# EAGLE design RavenLRS-Breakout (EAGLE 9.1.0)
REV: 1
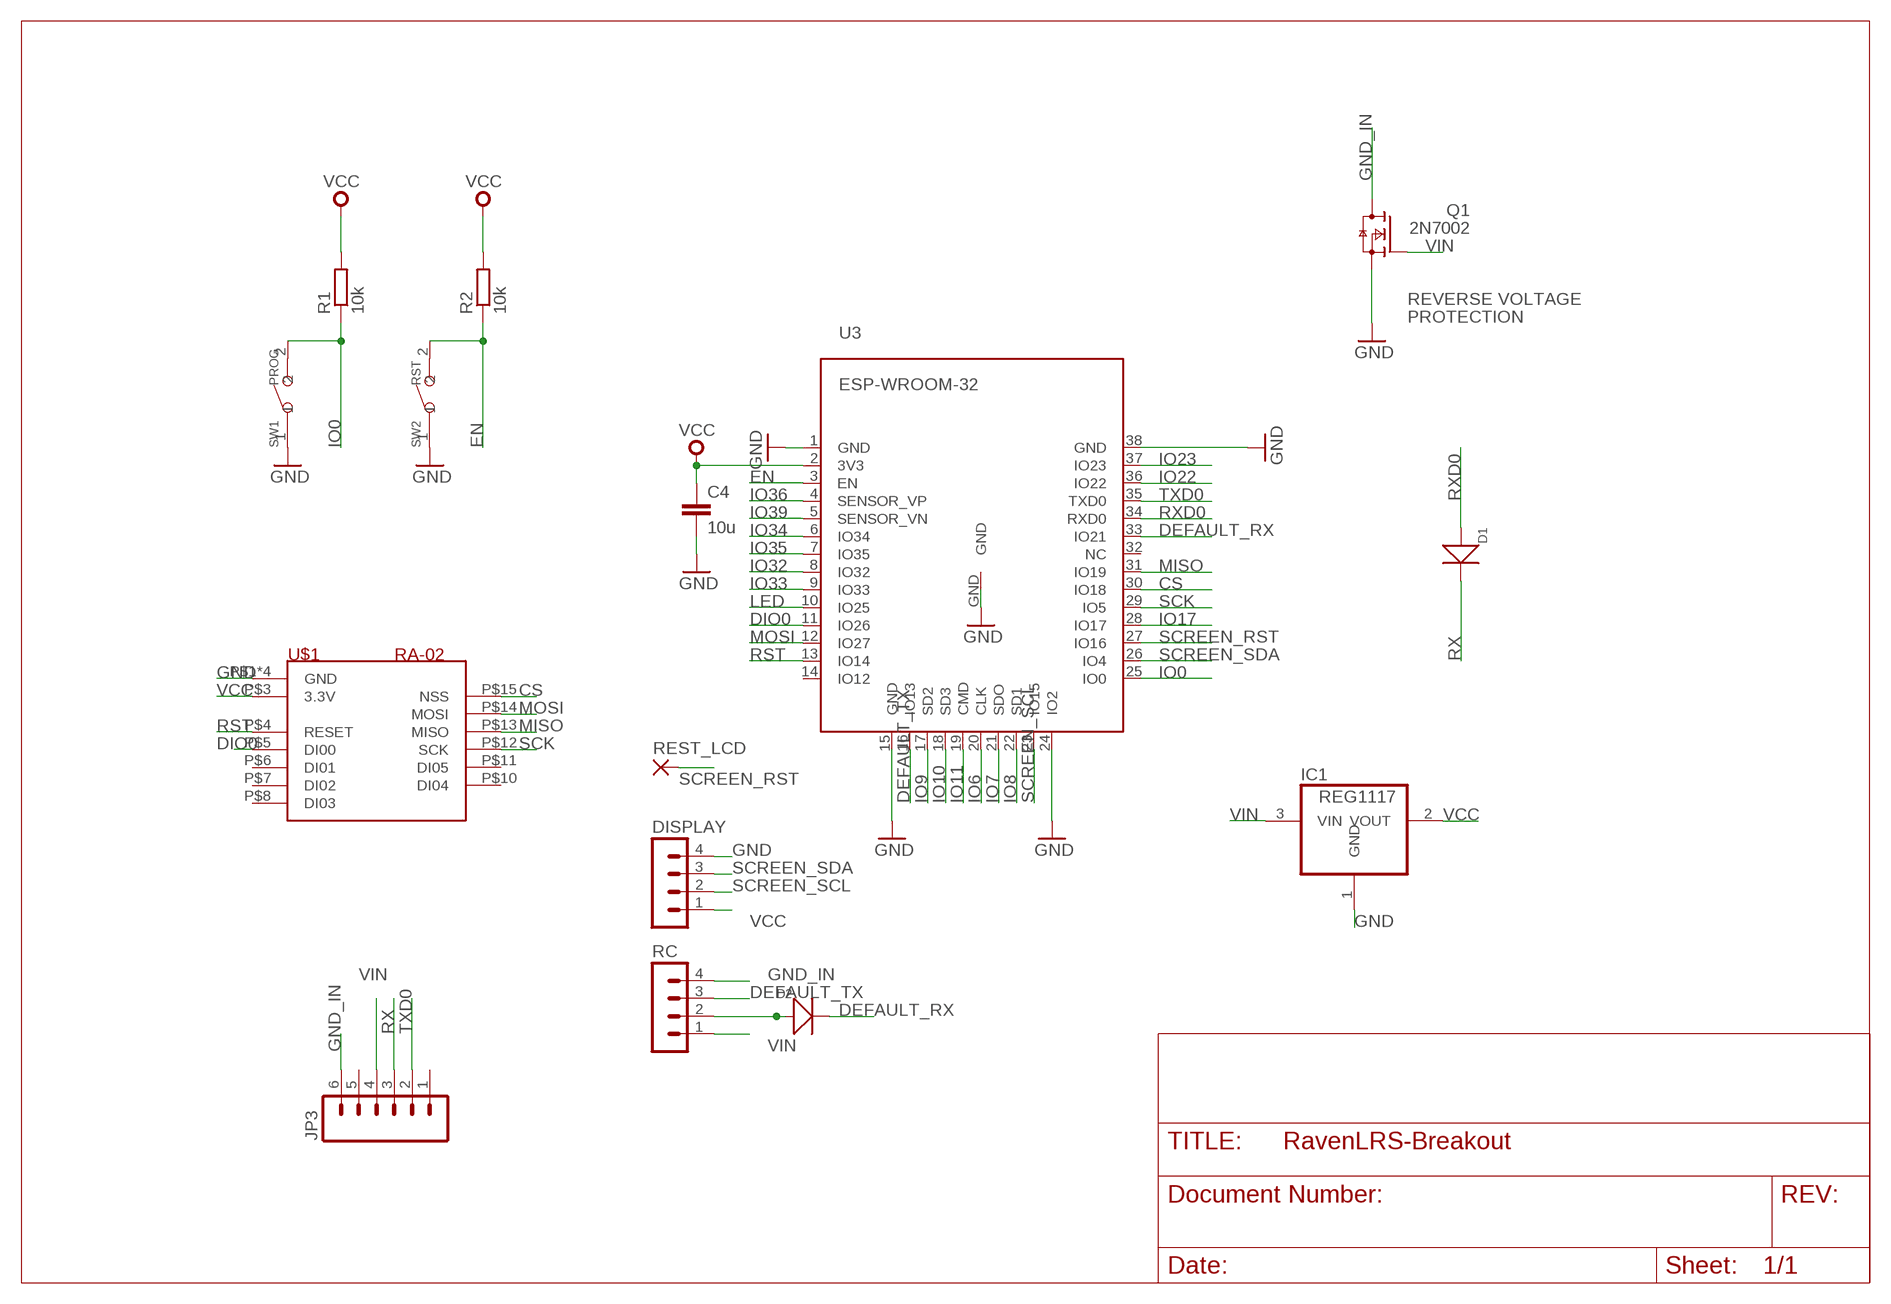
[diagram p0: schematic, sheet 1]

## Parts
C4  10u  C-EUC0603  [C0603]
D1  DIODE'0805'  [SOD-323]
D2  DIODE'0805'  [SOD-323]
DISPLAY  MA04-1  [MA04-1]
IC1  REG1117  [SOT223]
JP3  M06SILK_FEMALE_PTH  [1X06]
Q1  2N7002  2N7002E  [SOT23]
R1  10k  R-EU_R0603  [R0603]
R2  10k  R-EU_R0603  [R0603]
RC  MA04-1  [MA04-1]
REST_LCD  SMD2  [SMD1,27-2,54]
SW1  PROG  SMD-BUTTON(2P-6.0X3.0X2.5MM)-DHT-1163S  [SW2-4.0-6.0X3.0X2.5MM]
SW2  RST  SMD-BUTTON(2P-6.0X3.0X2.5MM)-DHT-1163S  [SW2-4.0-6.0X3.0X2.5MM]
U3  ESP-WROOM-32  [ESP-WROOM-32]
U$1  RA-02  [RA-02]

## Nets
CS: U3.30(IO18) U$1.P$15(NSS)
DEFAULT_RX: D2.- U3.33(IO21)
DEFAULT_TX: RC.3 U3.16(IO13)
DIO0: U3.11(IO26) U$1.P$5(DI00)
EN: R2.1 SW2.2 U3.3(EN)
GND [gnd]: C4.2 DISPLAY.4 IC1.1(GND) Q1.2(S) SW1.1 SW2.1 U3.1(GND) U3.15(GND) U3.24(IO2) U3.38(GND) U3.GND U$1.P$1(GND) U$1.P$2(GND) U$1.P$9(GND) U$1.P$16(GND)
GND_IN [gnd]: JP3.6 Q1.3(D) RC.4
IO0: R1.1 SW1.2 U3.25(IO0)
IO6: U3.20(CLK)
IO7: U3.21(SDO)
IO8: U3.22(SD1)
IO9: U3.17(SD2)
IO10: U3.18(SD3)
IO11: U3.19(CMD)
IO17: U3.28(IO17)
IO22: U3.36(IO22)
IO23: U3.37(IO23)
IO32: U3.8(IO32)
IO33: U3.9(IO33)
IO34: U3.6(IO34)
IO35: U3.7(IO35)
IO36: U3.4(SENSOR_VP)
IO39: U3.5(SENSOR_VN)
LED: U3.10(IO25)
MISO: U3.31(IO19) U$1.P$13(MISO)
MOSI: U3.12(IO27) U$1.P$14(MOSI)
N$7: D2.+ RC.2
RST: U3.13(IO14) U$1.P$4(RESET)
RX: D1.- JP3.3
RXD0: D1.+ U3.34(RXD0)
SCK: U3.29(IO5) U$1.P$12(SCK)
SCREEN_RST: REST_LCD.1(P) U3.27(IO16)
SCREEN_SCL: DISPLAY.2 U3.23(IO15)
SCREEN_SDA: DISPLAY.3 U3.26(IO4)
TXD0: JP3.2 U3.35(TXD0)
VCC [vcc]: C4.1 DISPLAY.1 IC1.2(VOUT) R1.2 R2.2 U3.2(3V3) U$1.P$3(3.3V)
VIN: IC1.3(VIN) JP3.4 Q1.1(G) RC.1
Unconnected: JP3.1 JP3.5 U3.14(IO12) U3.32(NC) U$1.P$6(DI01) U$1.P$7(DI02) U$1.P$8(DI03) U$1.P$10(DI04) U$1.P$11(DI05)

## Notes on the sheet
- REVERSE VOLTAGE
- PROTECTION

## Library data of the parts
C4 = rcl:C-EU: CAPACITOR, European symbol; SPICEPREFIX: C
D1 D2 = Seeed-OPL-Diode:DIODE*
DISPLAY RC = con-lstb:MA04-1: PIN HEADER; OC_FARNELL: unknown; OC_NEWARK: unknown
IC1 = burr-brown:REG1117: 800mA and 1A Low Dropout (LDO) Positive Regulator 1.8V, 2.5V, 2.85V, 3.3V, 5V, and Adj; MPN: REG1117; OC_FARNELL: 1097566; OC_NEWARK: 14P6981
JP3 = SparkFun-Connectors:M06: Header 6 Standard 6-pin 0.1" header. Use with straight break away headers (SKU : PRT-00116), right angle break away headers (PRT-00553), swiss pins (PRT-00743), machine pins (PRT-00117), and female headers (PRT-00115). Molex polarized connector foot print use with SKU : PRT-08094 with associated crimp pins and housings. NOTES ON THE VARIANTS LOCK and LOCK_LONGPADS... This footprint was designed to help hold the alignment of a through-hole component (i.e. 6-pin header) while soldering it into place. You may notice that each hole has been shifted either up or down by 0.005 of an inch from it's more standard position (which is a perfectly straight line). This slight alteration caused the pins (the squares in the middle) to touch the edges of the holes. Because they are alternating, it causes a "brace" to hold the component in place. 0.005 has proven to be the perfect amount of "off-center" position when using our standard breakaway headers. Although looks a little odd when you look at the bare footprint, once you have a header in there, the alteration is very hard to notice. Also,if you push a header all the way into place, it is covered up entirely on the bottom side. This idea of altering the position of holes to aid alignment will be further integrated into the Sparkfun Library for other footprints. It can help hold any component with 3 or more connection pins.; PROD_ID: CONN-08437
Q1 = nxp_60_1_1:2N7002: N-channel TrenchMOS FET N-channel enhancement mode Field-Effect Transistor (FET) in a plastic package using TrenchMOS technology. AAL Eindhoven MK
R1 R2 = rcl:R-EU_: RESISTOR, European symbol; SPICEPREFIX: R
REST_LCD = wirepad:SMD2: SMD PAD
SW1 SW2 = Seeed-OPL-Switch:SMD-BUTTON(2P-6.0X3.0X2.5MM): 311020029
U3 = esp32:ESP-WROOM-32
U$1 = AI-THINKER:RA-02

## Net classes
0 default: width 0.254 mm, drill 0.305 mm, clearance 0.152 mm
1 gnd: width 0.635 mm, drill 0.635 mm, clearance 0.254 mm
2 vcc: width 0.406 mm, drill 0.406 mm, clearance 0.254 mm

## Board
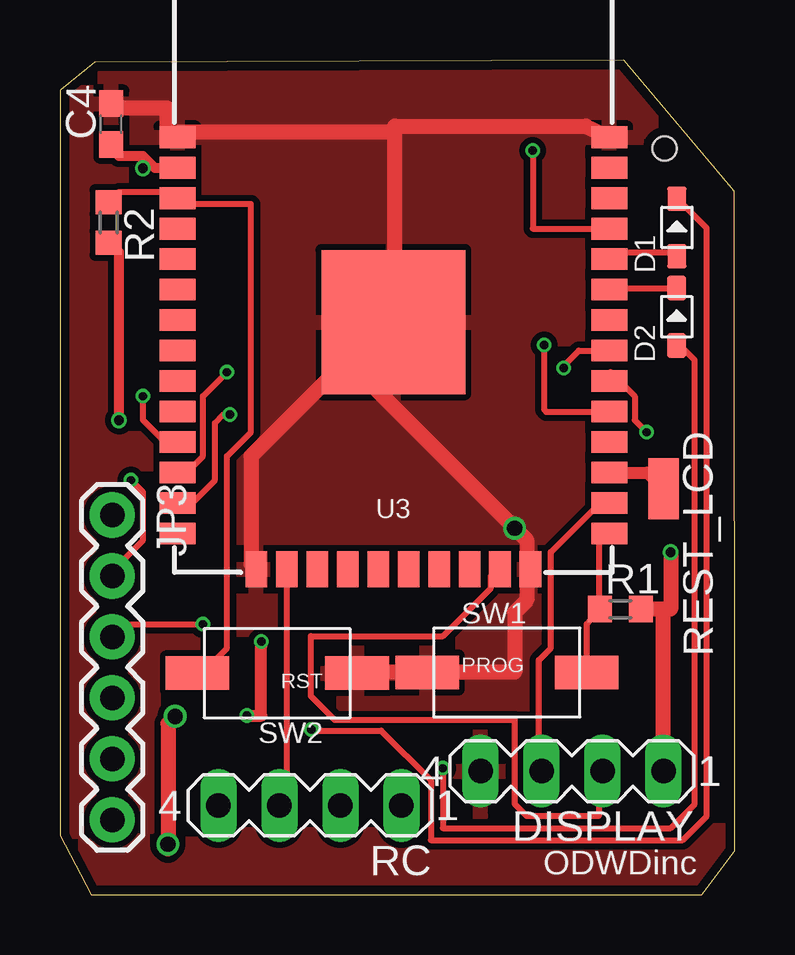
[diagram p1: board, top side]
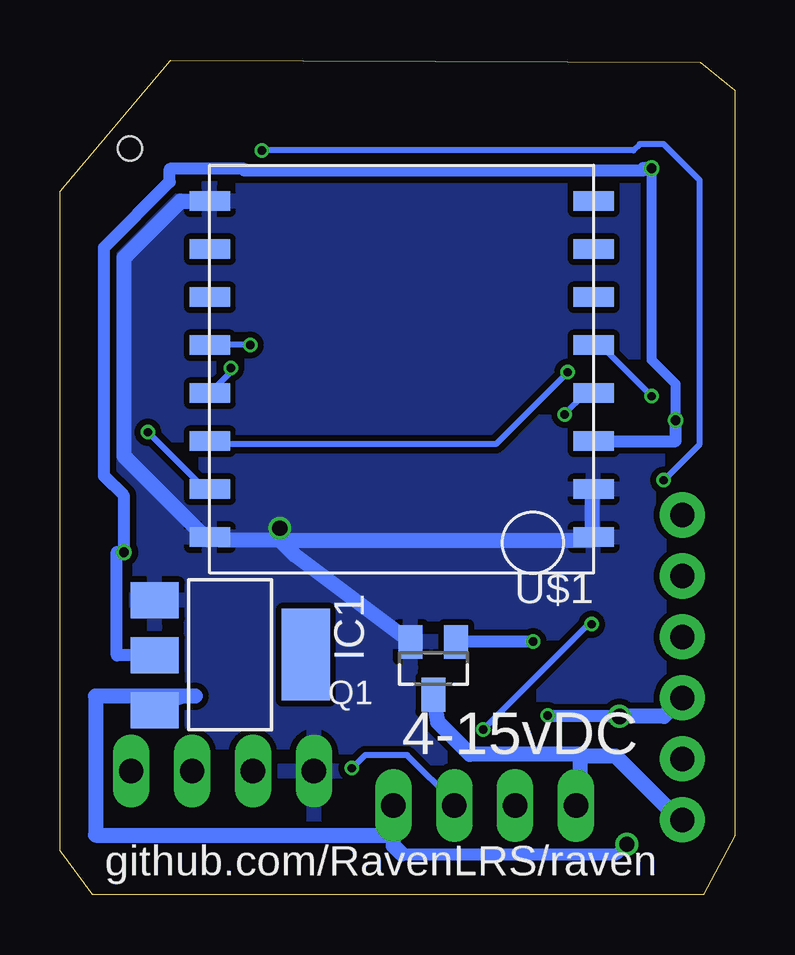
[diagram p2: board, bottom side, seen from below]

Size 28.13 x 34.78 mm. Coordinates in mm from the lower left corner, seen from the top.
Outline: 0,33.51 0,2.45 1.31,0 26.77,0 28.13,1.84 28.11,29.3 23.51,34.78 1.44,34.7 0,33.51
Copper layers (1*16): Top 0.035559375mm / dielectric 1.6mm / Bottom 0.035559375mm
Design rules "oshpark-2layer": minimum track width 6mil, minimum drill 10mil, track to track 6mil, track to pad 6mil, pad to pad 6mil, via to via 6mil, smd to smd 6mil, copper to edge 15mil, drill to drill 6mil, minimum pad ring 5mil, minimum via ring 5mil, stop-mask expansion 2.5mil, vias tented up to drill 0mil, thermal gap 10mil
Holes 1 mm at 25.21,31.09

### Footprints (pad centres in the part's own frame; a part is rotated, then mirrored left to right if it is on the bottom)
C0603 = smd 1.1 x 1: 1 -0.85,0; 2 0.85,0
SOD-323 = smd 1 x 0.8: + -1.2,0; - 1.2,0
MA04-1 = drill 1.016 long: 1 -3.81,0; 2 -1.27,0; 3 1.27,0; 4 3.81,0
SOT223 = smd 1.499 x 2.007: 1 -2.261,-3.15; 2 0.025,-3.15; 3 2.311,-3.15 | smd 3.81 x 2.007: 4 0,3.15
1X06 = drill 1.016 pad 1.88: 1 0,0; 2 2.54,0; 3 5.08,0; 4 7.62,0; 5 10.16,0; 6 12.7,0
SOT23 = smd 1 x 1.4: 1 -0.95,-1.1; 2 0.95,-1.1; 3 0,1.1
R0603 = smd 1 x 1.1: 1 -0.85,0; 2 0.85,0
SMD1,27-2,54 = smd 1.27 x 2.54: 1 0,0
SW2-4.0-6.0X3.0X2.5MM = smd 2.65 x 1.4: 1 -3.325,0; 2 3.325,0
ESP-WROOM-32 = smd 0.9 x 1.5: 1 7.7,9; 2 6.43,9; 3 5.16,9; 4 3.89,9; 5 2.62,9; 6 1.35,9; 7 0.08,9; 8 -1.19,9; 9 -2.46,9; 10 -3.73,9; 11 -5,9; 12 -6.27,9; 13 -7.54,9; 14 -8.81,9; 25 -8.81,-9; 26 -7.54,-9; 27 -6.27,-9; 28 -5,-9; 29 -3.73,-9; 30 -2.46,-9; 31 -1.19,-9; 32 0.08,-9; 33 1.35,-9; 34 2.62,-9; 35 3.89,-9; 36 5.16,-9; 37 6.43,-9; 38 7.7,-9 | smd 1.5 x 0.9: 15 -10.3,5.715; 16 -10.3,4.445; 17 -10.3,3.175; 18 -10.3,1.905; 19 -10.3,0.635; 20 -10.3,-0.635; 21 -10.3,-1.905; 22 -10.3,-3.175; 23 -10.3,-4.445; 24 -10.3,-5.715 | smd 6 x 6: GND 0,0
RA-02 = smd 1.676 x 0.813: P$1 0,-1.5; P$2 0,-3.5; P$3 0,-5.5; P$4 0,-7.5; P$5 0,-9.5; P$6 0,-11.5; P$7 0,-13.5; P$8 0,-15.5; P$9 16,-15.5; P$10 16,-13.5; P$11 16,-11.5; P$12 16,-9.5; P$13 16,-7.5; P$14 16,-5.5; P$15 16,-3.5; P$16 16,-1.5

### Placement (x,y rotation side)
C4  2.14,32.11 90 top
D1  25.72,27.8 90 top
D2  25.71,24.08 90 top
DISPLAY  21.35,5.15 180 top
IC1  21.03,10 270 bottom
JP3  2.18,15.82 270 top
Q1  12.56,9.43 180 bottom
R1  23.36,11.9 0 top
R2  2.03,28.01 270 top
RC  10.42,3.72 180 top
REST_LCD  25.16,16.91 180 top
SW1  18.63,9.26 0 top
SW2  9.06,9.23 180 top
U3  13.9,23.86 90 top
U$1  5.88,13.4 180 bottom

### Tracks (layer width: path | path; a pad name or v marks a point on that pad's centre or on a via)
CS  (via drill 0.35)
  Top 0.254: v24.46,19.27 23.96,19.77 23.96,20.77 22.96,21.77 U3.30
  Bottom 0.254: v24.46,19.27 21.96,16.77 U$1.P$15
DEFAULT_RX
  Top 0.254: D2.- 25.46,25.27 22.96,25.27 U3.33
DEFAULT_TX
  Top 0.254: U3.16 9.46,13.27 9.46,3.72 RC.3
DIO0  (via drill 0.35)
  Top 0.254: v3.46,20.77 3.46,19.77 4.46,18.77 U3.11
  Bottom 0.254: v3.46,20.77 5.46,22.77 U$1.P$5
EN
  Top 0.254: R2.1 2.46,29.27 4.46,29.27 U3.3 4.96,28.77 7.96,28.77 7.96,19.27 6.96,18.27 6.96,10.27 5.96,9.27 SW2.2
GND  (via drill 0.64)
  Top 0.635: SW2.1 12.46,9.27 14.96,9.27 SW1.1 15.46,9.27 18.96,9.27 18.96,11.77 19.46,12.27 19.46,13.27 U3.24 19.46,13.77 19.46,14.77 v18.96,15.27 11.96,22.27 | C4.2 2.46,32.77 4.46,32.77 4.46,31.77 U3.1 4.96,31.77 13.96,31.77 | 11.96,22.27 13.46,23.77 U3.GND | 11.96,22.27 7.96,18.27 7.96,13.77 U3.15 | 11.96,22.27 U3.GND | 13.96,31.77 13.96,32.02 21.94,32.02 U3.38 | U3.GND 13.96,24.27 13.96,31.77
  Bottom 0.635: 5.96,14.77 5.96,16.77 U$1.P$2 | 18.96,14.77 21.46,14.77 U$1.P$16 21.96,14.77 25.46,18.27 25.46,26.54 23.1,28.9 U$1.P$9 | 18.96,14.77 18.35,14.16 Q1.2 | 18.96,14.77 5.96,14.77 | 5.96,14.77 U$1.P$1 | v18.96,15.27 18.96,14.77
  pour Top: -0.58,-0.78 -0.58,36.05 31.17,36.05 31.17,-0.78
  pour Bottom: -0.58,36.05 31.17,36.05 31.17,-0.78 -0.58,-0.78
GND_IN
  Bottom 0.635: 6.46,5.77 4.96,5.77 2.46,3.27 JP3.6 | Q1.3 12.37,7.18 11.04,5.85 6.46,5.85 6.46,5.77 | RC.4 6.46,3.72 6.46,5.77
IO0
  Top 0.254: U3.25 22.46,14.77 22.46,11.95 R1.1 21.96,11.28 SW1.2
MISO  (via drill 0.35)
  Top 0.254: v21,21.95 21,22.03 21.63,22.66 21.63,22.67 U3.31
  Bottom 0.254: v21,21.95 21,21.78 U$1.P$13
MOSI  (via drill 0.35)
  Top 0.254: v6.96,21.77 5.96,20.77 5.96,18.27 4.96,17.27 U3.12
  Bottom 0.254: v6.96,21.77 9.96,18.77 21.46,18.77 U$1.P$14
N$7  (via drill 0.35)
  Top 0.254: v15.96,5.27 15.96,2.77 25.46,2.77 26.46,3.77 26.46,22.27 25.96,22.77 D2.+
  Bottom 0.254: v15.96,5.27 15.41,5.82 13.65,5.82 11.69,3.86 RC.2
RST  (via drill 0.35)
  Top 0.254: U3.13 4.96,16.27 5.46,16.27 6.46,17.27 6.46,19.66 6.81,20.01 v7.09,20.01
  Bottom 0.254: v7.09,20.01 6.2,20.9 U$1.P$4
RX  (via drill 0.35)
  Top 0.254: v5.96,11.27 2.46,11.27 2.46,10.77 JP3.3 | D1.- 25.96,28.77 26.96,27.77 26.96,3.27 25.96,2.27 15.46,2.27 15.46,4.77 13.39,6.84 10.53,6.84 v10.48,6.89
  Bottom 0.254: v10.48,6.89 6.1,11.27 v5.96,11.27
RXD0
  Top 0.254: D1.+ 25.46,26.77 22.96,26.77 U3.34
SCK  (via drill 0.35)
  Top 0.254: v20.19,22.91 20.19,20.21 20.28,20.12 U3.29
  Bottom 0.254: v20.19,22.91 21.19,22.91 21.35,22.88 21.42,22.9 U$1.P$12
SCREEN_RST
  Top 0.508: U3.27 24.48,17.59 REST_LCD.1
SCREEN_SCL
  Top 0.254: U3.23 17.96,13.27 17.96,12.77 15.96,10.77 10.46,10.77 10.46,8.27 11.46,7.27 18.96,7.27 18.96,3.77 19.46,3.27 22.46,3.27 22.46,4.86 DISPLAY.2
SCREEN_SDA
  Top 0.254: U3.26 22.46,16.27 20.46,14.27 20.46,10.27 19.96,9.77 19.96,5.24 DISPLAY.3
TXD0  (via drill 0.35)
  Top 0.254: v19.71,31.01 19.71,27.75 U3.35 | v2.96,17.27 3.46,16.77 3.46,14.77 2.46,13.77 JP3.2
  Bottom 0.254: v19.71,31.01 4.22,31.01 3.96,31.27 2.96,31.27 1.46,29.77 1.46,18.77 v2.96,17.27
VCC  (via drill 0.41)
  Top 0.406: 3.46,30.77 2.46,30.77 C4.1 | 3.46,30.77 3.96,30.27 4.46,30.27 U3.2 | v2.46,19.77 2.46,26.77 R2.2 | v3.46,30.27 3.46,30.77
  Top 0.635: v25.46,14.27 25.46,11.9 24.82,11.9 | 24.82,11.9 R1.2 | DISPLAY.1 25.16,11.9 24.82,11.9
  Bottom 0.406: v3.46,30.27 3.46,29.77 3.46,22.27 2.46,21.27 v2.46,19.77
  Bottom 0.508: U$1.P$3 2.46,18.9 v2.46,19.77 | v3.46,30.27 3.83,30.27 3.83,30.17 20.45,30.17 20.45,30.25 23.55,30.25 23.55,29.7 26.29,26.96 26.29,17.45 25.46,16.62 v25.46,14.27 v25.46,14.28 25.76,14.28 25.76,9.98 IC1.2
VIN  (via drill 0.35, 0.64)
  Top 0.508: 4.5,1.9 v4.5,2.1 | v7.79,7.46 8.39,7.46 8.39,10.36 v8.39,10.55 v8.4,10.55
  Top 0.635: v4.8,7.43 4.5,7.13 4.5,1.9
  Bottom 0.254: IC1.3 22.49,8.27
  Bottom 0.508: 13.88,1.69 4.92,1.69 v4.5,2.1 | v4.8,7.43 7.69,7.43 7.72,7.46 v7.79,7.46 | v8.4,10.55 8.4,10.53 Q1.1 | 14.23,2.04 RC.1
  Bottom 0.635: 22.49,8.27 26.64,8.27 26.64,2.48 14.23,2.48 14.23,2.04 13.88,1.69 | JP3.4 2.95,7.43 v4.8,7.43

### Text on the board
tNames: ODWDinc
bNames: 4-15vDC | github.com/RavenLRS/raven